# Altium schematic sheet tl.SchDoc
size B
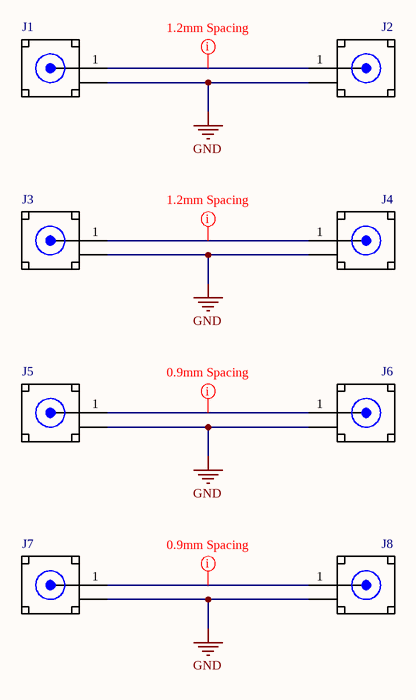
[diagram p0: tl.SchDoc]

## Parts
J1  SMA-J-P-H-ST-EM1  [SAMTEC SMA-J-P-H-ST-EM1]  (value not drawn)
J2  SMA-J-P-H-ST-EM1  [SAMTEC SMA-J-P-H-ST-EM1]  (value not drawn)
J3  SMA-J-P-H-ST-EM1  [SAMTEC SMA-J-P-H-ST-EM1]  (value not drawn)
J4  SMA-J-P-H-ST-EM1  [SAMTEC SMA-J-P-H-ST-EM1]  (value not drawn)
J5  SMA-J-P-H-ST-EM1  [SAMTEC SMA-J-P-H-ST-EM1]  (value not drawn)
J6  SMA-J-P-H-ST-EM1  [SAMTEC SMA-J-P-H-ST-EM1]  (value not drawn)
J7  SMA-J-P-H-ST-EM1  [SAMTEC SMA-J-P-H-ST-EM1]  (value not drawn)
J8  SMA-J-P-H-ST-EM1  [SAMTEC SMA-J-P-H-ST-EM1]  (value not drawn)

## Nets
GND: J1.2(GND) J2.2(GND) J3.2(GND) J4.2(GND) J5.2(GND) J6.2(GND) J7.2(GND) J8.2(GND)
NetJ1_1: J1.1(SIGNAL) J2.1(SIGNAL)
NetJ3_1: J3.1(SIGNAL) J4.1(SIGNAL)
NetJ5_1: J5.1(SIGNAL) J6.1(SIGNAL)
NetJ7_1: J7.1(SIGNAL) J8.1(SIGNAL)

## Layout directives
net class 1.2mm Spacing: NetJ1_1, NetJ3_1
net class 0.9mm Spacing: NetJ5_1, NetJ7_1

## Library data of the parts
J1-J8 = SMA-J-P-H-ST-EM1: CONN SMA JACK STR 50OHM EDGE MNT; Manufacturer: Samtec Inc.; Frequency - Max: 20GHz; Number of Ports: 1; Body Material: Brass; Body Finish: Gold; Dialetric Material: Polytetrafluoroethylene (PTFE); Center Contact Material: Beryllium Copper; Voltage Rating: 335V; Part Number: SMA-J-P-H-ST-EM1; ComponentLink1Description: Datasheet; ComponentLink1URL: http://suddendocs.samtec.com/catalog_english/sma.pdf; ComponentLink2Description: Drawing; ComponentLink2URL: http://suddendocs.samtec.com/prints/sma-j-p-x-st-em1-mkt.pdf; ComponentLink3Description: Digikey Link; ComponentLink3URL: https://www.digikey.com/products/en?keywords=SMA-J-P-H-ST-EM1; Device Package: Tray; Features: -; LastUpdated: 2020-03-11 6:05:05 AM; Lifecycle Status: Active; Minimum Order: 1; Operating Temperature: -65°C ~ 125°C; Packaging: Tray; Part Status: Active; Price: 4.33; Series: -; Supplier 1: DigiKey; Supplier Part Number 1: SAM8857-ND; Mounting Type: Board Edge, End Launch; Mounting Feature: -; Cable Group: -; Fastening Type: Threaded; Housing Color: Gold; Center Contact Plating: Gold; Mating Cycles: -; Insertion Loss: -; Connector Style: SMA